# Altium schematic sheet 5V2.4A.SchDoc
size A4; SheetNumber: 1; SheetTotal: 1
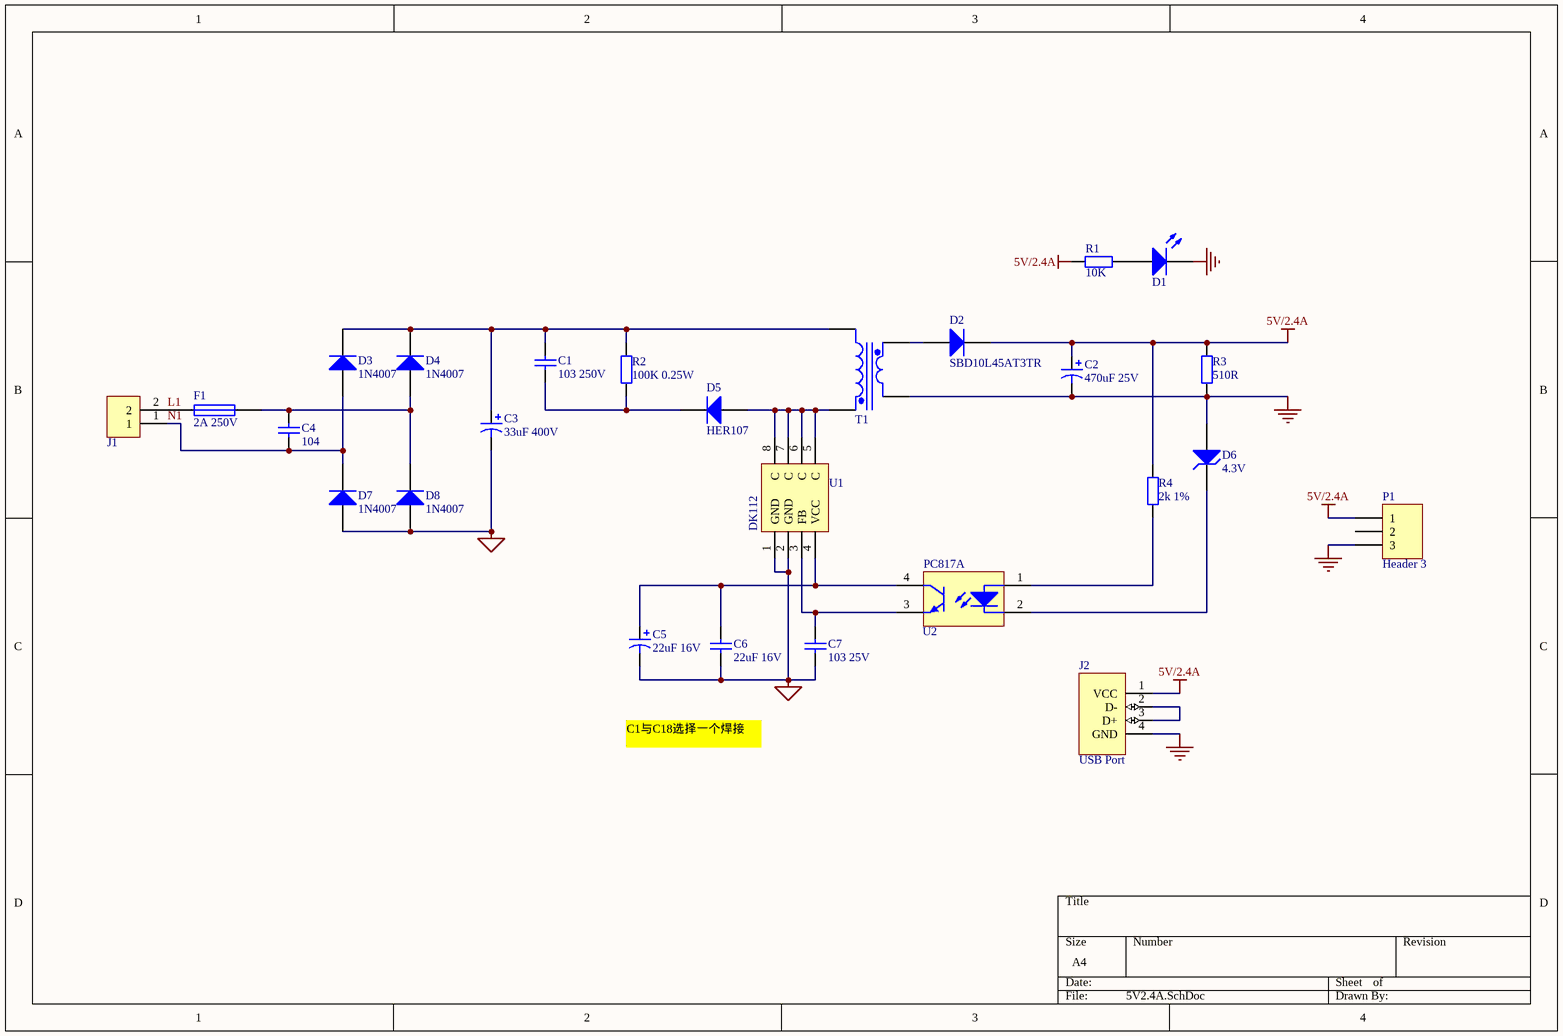
[diagram p0: 5V2.4A.SchDoc]

## Parts
C1  103 250V  [CAP_0805]
C2  470uF 25V  [CAP POLL 直插电解质8*12/8*16]
C3  33uF 400V  [Cap POLL 直插电解质 13*20]
C4  104  [Cap安规104]
C5  22uF 16V  [CAP POLL 直插电解质5*12]
C6  22uF 16V  [1210]
C7  103 25V  [CAP瓷片直插]
D1  LED_  [LED_0805]  (value not drawn)
D2  SBD10L45AT3TR  [TO-277]
D3  1N4007  [直插二极管]
D4  1N4007  [直插二极管]
D5  HER107  [DO-41]
D6  4.3V  [LL-34]
D7  1N4007  [直插二极管]
D8  1N4007  [直插二极管]
F1  I hold: 2A 250V  [2410]  (hidden comment: Fuse)
J1  接线端子2P  [接线端子2P]  (value not drawn)
J2  USB Port  [USB-A 母座 贴片]
P1  Header 3  [HDR1X3]
R1  10K  [Res_0805]
R2  100K 0.25W  [1206]
R3  510R  [Res_0805]
R4  2k 1%  [Res_0805]
T1  变压器-双边-8引脚  [变压器EE20-5_5-剪脚]  (value not drawn)
U1  DK112  [DIP-8]
U2  PC817A  [DIP-4]

## Nets
5V/2.4A: C2.1 D2.2(K) J2.1(VCC) P1.1 R1.2 R3.2 R4.2
GND1: C2.2 D1.2(K) D6.1(A) J2.4(GND) P1.3 R3.1 T1.6(Sec-)
PGND1: C3.2 C5.2 C6.1 C7.1 D7.1(A) D8.1(A) U1.1(GND) U1.2(GND)
L1: F1.1 J1.2
N1: C4.1 D3.1(A) D7.2(K) J1.1
NetC1_1: C1.1 D5.2(K) R2.1
NetC1_2: C1.2 C3.1 D3.2(K) D4.2(K) R2.2 T1.1(Pri+)
NetC4_2: C4.2 D4.1(A) D8.2(K) F1.2
NetC5_1: C5.1 C6.2 U1.4(VCC) U2.4(C)
NetC7_2: C7.2 U1.3(FB) U2.3(E)
NetD1_1: D1.1(A) R1.1
NetD2_1: D2.1(A) T1.7(Sec+)
NetD5_1: D5.1(A) T1.4(Pri-) U1.5(C) U1.6(C) U1.7(C) U1.8(C)
NetD6_2: D6.2(K) U2.2(K)
NetJ2_2: J2.2(D-) J2.3(D+)
NetR4_1: R4.1 U2.1(A)

Not connected (* = marked no-connect by the designer): P1 2

## Notes on the sheet
- C1与C18选择一个焊接

## Library data of the parts
C1 C4 C6 C7 = Cap_2
  C1: Value: 103 250V
  C4: Value: 104
  C6: Value: 22uF 16V
  C7: Value: 103 25V
C2 C3 C5 = Cap_
  C2: Value: 470uF 25V
  C3: Value: 33uF 400V
  C5: Value: 22uF 16V
D2 D5 = 1N4007
D6 = 稳压二极管: Value: 4.3V
P1 = Header 3: Header, 3-Pin; LatestRevisionDate: 17-Jul-2002; LatestRevisionNote: Re-released for DXP Platform.; Publisher: Altium Limited
R1-R4 = Res_
  R1: Value: 10K
  R2: Value: 100K 0.25W
  R3: Value: 510R
  R4: Value: 2k 1%
U2 = 光耦 - 1